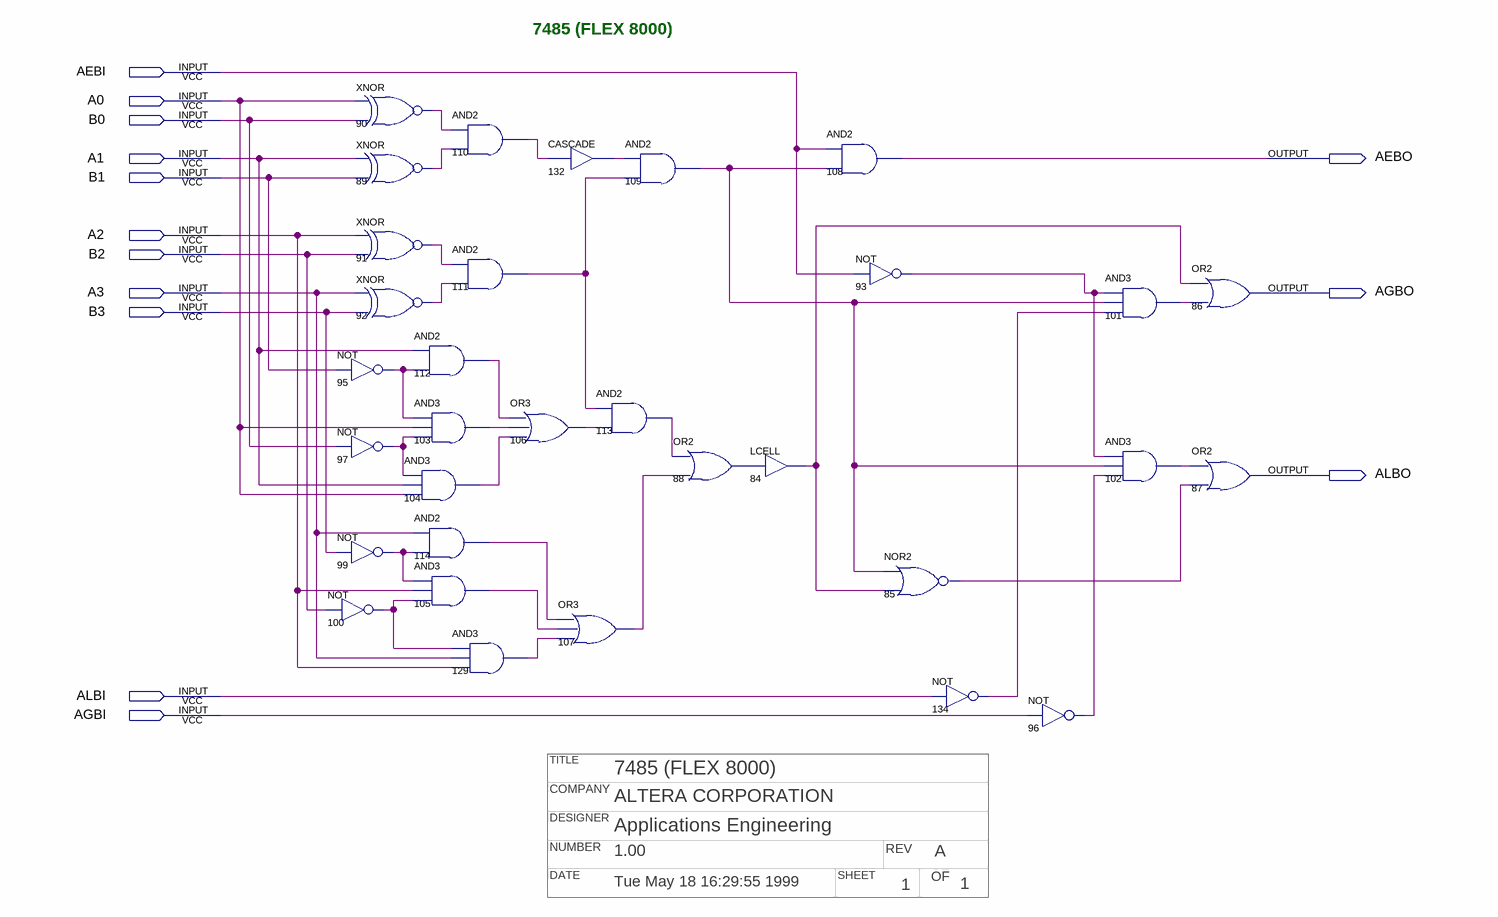
[diagram p0: schematic sheet]
// Quartus schematic f7485.bdf as structural Verilog: 32 symbols, 14 pins
// Title block: TITLE: 7485 (FLEX 8000); COMPANY: ALTERA CORPORATION; DESIGNER: Applications Engineering; NUMBER: 1.00; REV: A; DATE: Tue May 18 16:29:55 1999; SHEET: 1; OF: 1
module f7485 (
  input  AEBI,
  input  A0,
  input  B0,
  input  A1,
  input  B1,
  input  A2,
  input  B2,
  input  A3,
  input  B3,
  input  ALBI,
  input  AGBI,
  output AEBO,
  output AGBO,
  output ALBO
);

  wire n84_out, n85_out, n88_out, n89_out, n90_out, n91_out, n92_out, n93_out, n95_out, n96_out, n97_out,
       n99_out, n100_out, n101_out, n102_out, n103_out, n104_out, n105_out, n106_out, n107_out, n109_out,
       n110_out, n111_out, n112_out, n113_out, n114_out, n129_out, n132_out, n134_out;

  xnor u_90 (n90_out, A0, B0);
  xnor u_89 (n89_out, A1, B1);
  xnor u_91 (n91_out, A2, B2);
  xnor u_92 (n92_out, A3, B3);
  not u_95 (n95_out, B1);
  not u_97 (n97_out, B0);
  not u_99 (n99_out, B3);
  not u_100 (n100_out, B2);
  and u_110 (n110_out, n90_out, n89_out);
  and u_111 (n111_out, n91_out, n92_out);
  and u_112 (n112_out, A1, n95_out);
  and u_103 (n103_out, n95_out, A0, n97_out);
  and u_104 (n104_out, n97_out, A1, A0);
  and u_114 (n114_out, A3, n99_out);
  and u_105 (n105_out, n99_out, A2, n100_out);
  and u_129 (n129_out, n100_out, A3, A2);
  CASCADE u_132 (.IN(n110_out), .OUT(n132_out));
  or u_106 (n106_out, n112_out, n103_out, n104_out);
  and u_109 (n109_out, n132_out, n111_out);
  and u_113 (n113_out, n111_out, n106_out);
  or u_107 (n107_out, n114_out, n105_out, n129_out);
  or u_88 (n88_out, n113_out, n107_out);
  LCELL u_84 (.IN(n88_out), .OUT(n84_out));
  and u_108 (AEBO, AEBI, n109_out);
  not u_93 (n93_out, AEBI);
  nor u_85 (n85_out, n109_out, n84_out);
  not u_134 (n134_out, ALBI);
  not u_96 (n96_out, AGBI);
  and u_101 (n101_out, n93_out, n109_out, n134_out);
  and u_102 (n102_out, n93_out, n109_out, n96_out);
  or u_86 (AGBO, n84_out, n101_out);
  or u_87 (ALBO, n102_out, n85_out);

  // Notes on the sheet:
  //   7485 (FLEX 8000)
endmodule
